# Altium schematic sheet Sheet6.SchDoc
size A4
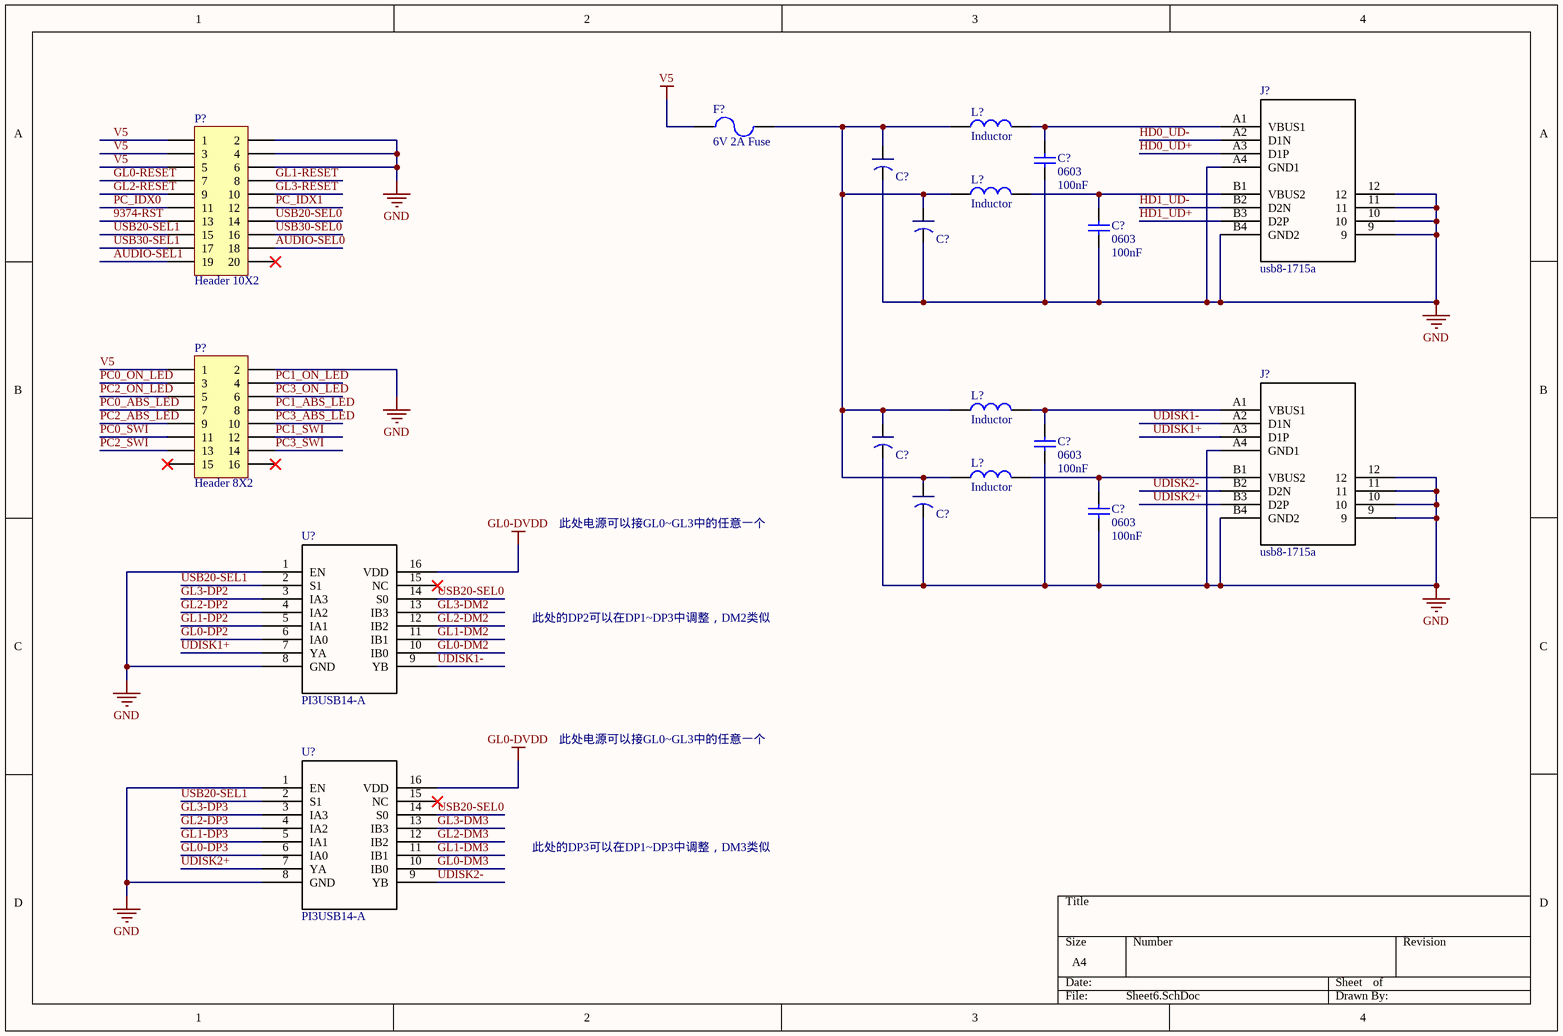
[diagram p0: Sheet6.SchDoc]

## Parts
(Parts that share a designator on the sheet are numbered #1, #2 ... from top to bottom, then left to right.)
C?#1  Capacitor  [C0603]  (value not drawn)
C?#2  0603  value 100nF  [1608[0603]]
C?#3  Capacitor  [C0603]  (value not drawn)
C?#4  0603  value 100nF  [1608[0603]]
C?#5  Capacitor  [C0603]  (value not drawn)
C?#6  0603  value 100nF  [1608[0603]]
C?#7  Capacitor  [C0603]  (value not drawn)
C?#8  0603  value 100nF  [1608[0603]]
F?  6V 2A Fuse  [FUSE]
J?#1  usb8-1715a  [usb8-1715a]
J?#2  usb8-1715a  [usb8-1715a]
L?#1  Inductor  [CD127]
L?#2  Inductor  [CD127]
L?#3  Inductor  [CD127]
L?#4  Inductor  [CD127]
P?#1  Header 10X2  [HDR2X10]
P?#2  Header 8X2  [HDR2X8]
U?#1  PI3USB14-A  [sop16-26-064a]
U?#2  PI3USB14-A  [sop16-26-064a]

## Nets
GL0-DVDD: U?#1.16(VDD) U?#2.16(VDD)
GND: C?#1.2 C?#2.1 C?#3.2 C?#4.1 C?#5.2 C?#6.1 C?#7.2 C?#8.1 J?#1.9 J?#1.10 J?#1.11 J?#1.12 J?#1.A4(GND1) J?#1.B4(GND2) J?#2.9 J?#2.10 J?#2.11 J?#2.12 J?#2.A4(GND1) J?#2.B4(GND2) P?#1.2 P?#1.4 P?#1.6 P?#2.2 U?#1.1(EN) U?#1.8(GND) U?#2.1(EN) U?#2.8(GND)
V5: F?.2 P?#1.1 P?#1.3 P?#1.5 P?#2.1
9374-RST: P?#1.13
AUDIO-SEL0: P?#1.18
AUDIO-SEL1: P?#1.19
GL0-DM2: U?#1.10(IB0)
GL0-DM3: U?#2.10(IB0)
GL0-DP2: U?#1.6(IA0)
GL0-DP3: U?#2.6(IA0)
GL0-RESET: P?#1.7
GL1-DM2: U?#1.11(IB1)
GL1-DM3: U?#2.11(IB1)
GL1-DP2: U?#1.5(IA1)
GL1-DP3: U?#2.5(IA1)
GL1-RESET: P?#1.8
GL2-DM2: U?#1.12(IB2)
GL2-DM3: U?#2.12(IB2)
GL2-DP2: U?#1.4(IA2)
GL2-DP3: U?#2.4(IA2)
GL2-RESET: P?#1.9
GL3-DM2: U?#1.13(IB3)
GL3-DM3: U?#2.13(IB3)
GL3-DP2: U?#1.3(IA3)
GL3-DP3: U?#2.3(IA3)
GL3-RESET: P?#1.10
HD0_UD+: J?#1.A3(D1P)
HD0_UD-: J?#1.A2(D1N)
HD1_UD+: J?#1.B3(D2P)
HD1_UD-: J?#1.B2(D2N)
PC0_ABS_LED: P?#2.7
PC0_ON_LED: P?#2.3
PC0_SWI: P?#2.11
PC1_ABS_LED: P?#2.8
PC1_ON_LED: P?#2.4
PC1_SWI: P?#2.12
PC2_ABS_LED: P?#2.9
PC2_ON_LED: P?#2.5
PC2_SWI: P?#2.13
PC3_ABS_LED: P?#2.10
PC3_ON_LED: P?#2.6
PC3_SWI: P?#2.14
PC_IDX0: P?#1.11
PC_IDX1: P?#1.12
UDISK1+: J?#2.A3(D1P) U?#1.7(YA)
UDISK1-: J?#2.A2(D1N) U?#1.9(YB)
UDISK2+: J?#2.B3(D2P) U?#2.7(YA)
UDISK2-: J?#2.B2(D2N) U?#2.9(YB)
USB20-SEL0: P?#1.14 U?#1.14(S0) U?#2.14(S0)
USB20-SEL1: P?#1.15 U?#1.2(S1) U?#2.2(S1)
USB30-SEL0: P?#1.16
USB30-SEL1: P?#1.17
NetC?#1_1: C?#1.1 C?#3.1 C?#5.1 C?#7.1 F?.1 L?#1.1 L?#2.1 L?#3.1 L?#4.1
NetC?#2_2: C?#2.2 J?#1.A1(VBUS1) L?#1.2
NetC?#4_2: C?#4.2 J?#1.B1(VBUS2) L?#2.2
NetC?#6_2: C?#6.2 J?#2.A1(VBUS1) L?#3.2
NetC?#8_2: C?#8.2 J?#2.B1(VBUS2) L?#4.2

Not connected (* = marked no-connect by the designer): P?#1 20*; P?#2 15* 16*; U?#1 15(NC)*; U?#2 15(NC)*

## Notes on the sheet
- 此处电源可以接GL0~GL3中的任意一个
- 此处的DP2可以在DP1~DP3中调整，DM2类似
- 此处的DP3可以在DP1~DP3中调整，DM3类似

## Library data of the parts
C?#2 C?#4 C?#6 C?#8 = Cap Semi: Capacitor (Semiconductor SIM Model); Published: 8-Jun-2000; LatestRevisionDate: 29-May-2009; LatestRevisionNote: IPC-7351 Footprint Added.; PackageReference: C1206; Publisher: Altium Limited; PackageDescription: Chip Capacitor
F? = FUSE
J?#1 J?#2 = usb8-1715a: Imported; RefDes: RefDes; Type: DEV; Value: Value
P?#1 = Header 10X2: Header, 10-Pin, Dual row; LatestRevisionDate: 17-Jul-2002; LatestRevisionNote: Re-released for DXP Platform.; Publisher: Altium Limited
P?#2 = Header 8X2: Header, 8-Pin, Dual row; LatestRevisionDate: 17-Jul-2002; LatestRevisionNote: Re-released for DXP Platform.; Publisher: Altium Limited
U?#1 U?#2 = PI3USB14-A: Imported; Designer: Chiphome; Device: PI3USB14-A; RefDes: RefDes; Type: DEV; Value: Value